# EAGLE schematic TIEVOX Interface (EAGLE 7.4.0)
Power Notes For IC_PWR_1 to work the way we want it to, meaning supplying power from the car, a value of 2.2K - 6K will work just fine for R1. That gives a turn on voltage of 5.5VDC to ~10VDC. All power inputs are poly fused and have a backpower diode circuit for protecting the RPi.
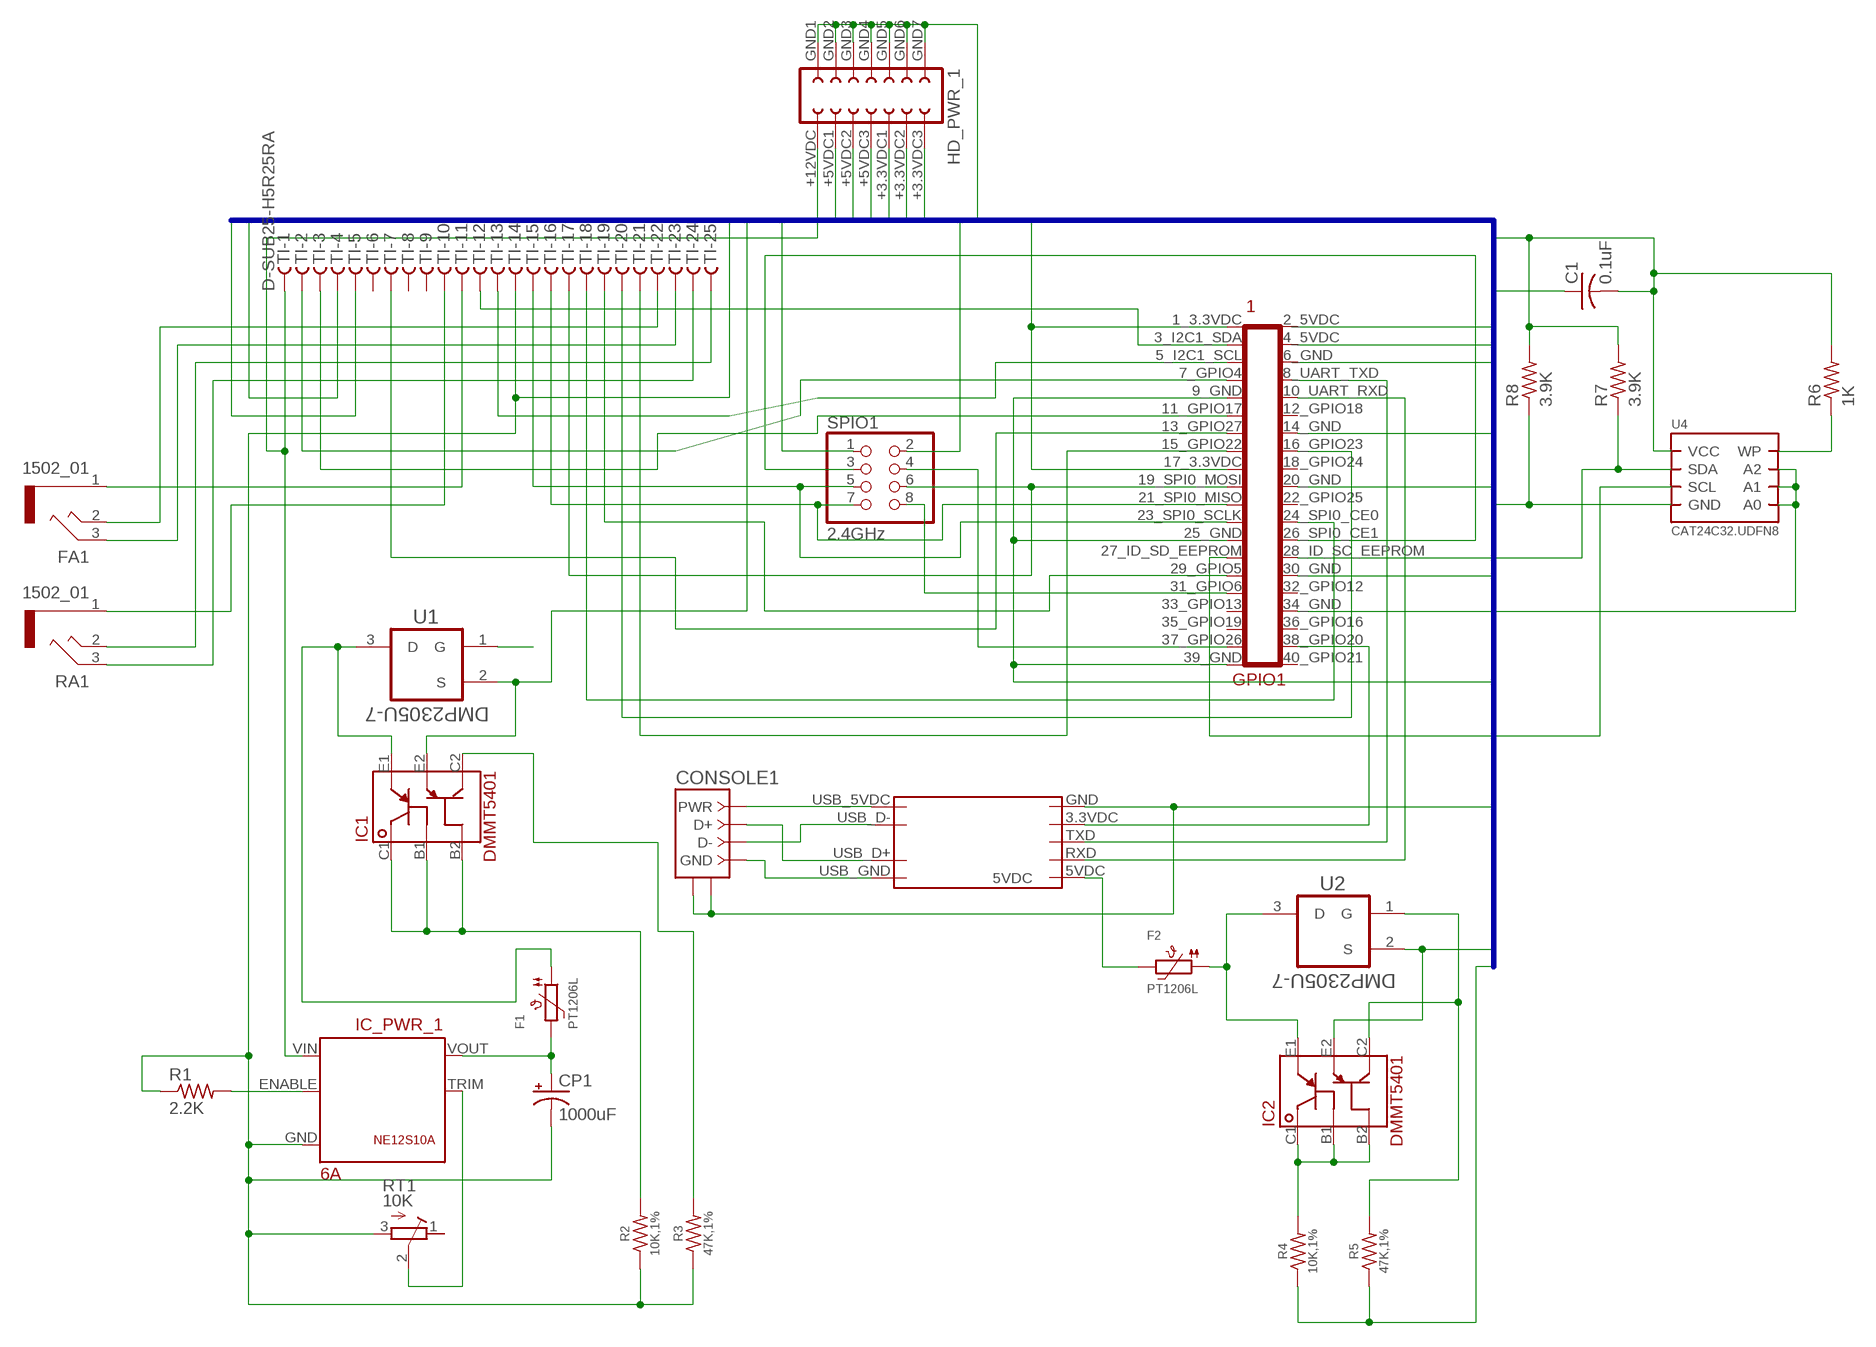
[diagram p0: schematic, sheet 1]

## Parts
C1  0.1uF  C-USC1005  [C1005]
CONSOLE1  USB-RA  [USBBF-1]
CP1  1000uF  CPOL-USE3.5-8  [E3,5-8]
F1  PT1206L  PTC1206  [1206]
F2  PT1206L  PTC1206  [1206]
FA1  1502_01  [1502_01]
GPIO1  RPI_GPIOUPPER  [RPI_GPIO_MALE]
HD_PWR_1  PWR_HDR_FEMALE_2X7  [PWR_HDR_FEMALE_2X7]
IC1  DMMT5401  DMMT5401DMMT  [DMMT5401]
IC2  DMMT5401  DMMT5401DMMT  [DMMT5401]
IC_PWR_1  6A  NE12S12V6A  [NE12S]
R1  2.2K  R-US_0207/10  [0207/10]
R2  10K,1%  R-US_01005  [R01005]
R3  47K,1%  R-US_01005  [R01005]
R4  10K,1%  R-US_01005  [R01005]
R5  47K,1%  R-US_01005  [R01005]
R6  1K  R-US_R1005  [R1005]
R7  3.9K  R-US_R1005  [R1005]
R8  3.9K  R-US_R1005  [R1005]
RA1  1502_01  [1502_01]
RT1  10K  R-TRIMM3006P  [RTRIM3006P]
SPIO1  2.4GHz  PINHD-2X4  [2X04]
TI  D-SUB25-H5R25RA  [H5R25RA]
U1  DMP2305U-7  [SOT103P240X110-3N]
U2  DMP2305U-7  [SOT103P240X110-3N]
U4  CAT24C32.UDFN8  CAT24CXX.UDFN8  [UDFN8]
UART1  GS27159  [GS27159]

## Nets
5VDC: F2.2 UART1.5VDC
+3.3VDC: C1.2 GPIO1.1_3.3VDC GPIO1.17_3.3VDC HD_PWR_1.+3.3VDC1 HD_PWR_1.+3.3VDC2 HD_PWR_1.+3.3VDC3 R6.2 R7.2 R8.2 SPIO1.2 TI.4 U4.8(VCC)
+5VDC: GPIO1.2_5VDC GPIO1.4_5VDC HD_PWR_1.+5VDC1 HD_PWR_1.+5VDC2 HD_PWR_1.+5VDC3 IC1.E2 IC2.E2 TI.5 U1.2(S) U2.2(S)
CONSOLE_ON: GPIO1.38_GPIO20 UART1.3.3VDC
GND: C1.1 CONSOLE1.CASE1(SHIELD1) CONSOLE1.CASE2(SHIELD2) CP1.- GPIO1.6_GND GPIO1.9_GND GPIO1.14_GND GPIO1.20_GND GPIO1.25_GND GPIO1.30_GND GPIO1.34_GND GPIO1.39_GND HD_PWR_1.GND1 HD_PWR_1.GND2 HD_PWR_1.GND3 HD_PWR_1.GND4 HD_PWR_1.GND5 HD_PWR_1.GND6 HD_PWR_1.GND7 IC_PWR_1.GND R1.1 R2.1 R3.1 R4.1 R5.1 R8.1 RT1.3(A) SPIO1.1 TI.14 U4.1(A0) U4.2(A1) U4.3(A2) U4.4(GND) U4.PAD(GND) UART1.GND
N$1: GPIO1.19_SPI0_MOSI SPIO1.6 TI.17
N$2: GPIO1.21_SPI0_MISO SPIO1.7 TI.16
N$3: GPIO1.23_SPI0_SCLK SPIO1.5 TI.15
N$4: GPIO1.26_SPI0_CE1 SPIO1.3
N$5: GPIO1.31_GPIO6 SPIO1.8
N$6: GPIO1.37_GPIO26 SPIO1.4
N$7: GPIO1.7_GPIO4 TI.2
N$8: GPIO1.11_GPIO17 TI.3
N$9: GPIO1.13_GPIO27 TI.7
N$10: GPIO1.24_SPI0_CE0 TI.18
N$11: GPIO1.29_GPIO5 TI.19
N$12: GPIO1.16_GPIO23 TI.20
N$13: GPIO1.15_GPIO22 TI.21
N$14: CONSOLE1.4(GND) UART1.USB_GND
N$15: CONSOLE1.1(PWR) UART1.USB_5VDC
N$16: CONSOLE1.2(D-) UART1.USB_D-
N$17: CONSOLE1.3(D+) UART1.USB_D+
N$18: GPIO1.8_UART_TXD(8_UART0_TXD) UART1.TXD
N$19: GPIO1.10_UART_RXD(10_UART0_RXD) UART1.RXD
N$20: FA1.1 TI.11
N$21: RA1.1 TI.10
N$22: RA1.3 TI.24
N$23: RA1.2 TI.25
N$24: FA1.3 TI.23
N$25: FA1.2 TI.22
N$26: GPIO1.3_I2C1_SDA TI.12
N$27: GPIO1.5_I2C1_SCL TI.13
N$28: CP1.+ F1.2 IC_PWR_1.VOUT
N$29: IC_PWR_1.ENABLE R1.2
N$30: F1.1 IC1.E1 U1.3(D)
N$31: IC1.B1 IC1.B2 IC1.C1 R2.2
N$32: F2.1 IC2.E1 U2.3(D)
N$33: IC1.C2 R3.2
N$34: IC2.C2 R5.2 U2.1(G)
N$35: IC2.B1 IC2.B2 IC2.C1 R4.2
N$36: U1.1(G)
N$38: GPIO1.27_ID_SD_EEPROM(27_ID_SC_EEPROM) U4.6(SCL)
N$39: R6.1 U4.7(WP)
N$40: GPIO1.28_ID_SC_EEPROM R7.1 U4.5(SDA)
PWR12_IN: HD_PWR_1.+12VDC IC_PWR_1.VIN TI.1
PWR12_TRIM: IC_PWR_1.TRIM RT1.2(S)
Unconnected: GPIO1.12_GPIO18 GPIO1.18_GPIO24 GPIO1.22_GPIO25 GPIO1.32_GPIO12 GPIO1.33_GPIO13 GPIO1.35_GPIO19 GPIO1.36_GPIO16 GPIO1.40_GPIO21 RT1.1(E) TI.6 TI.8 TI.9

## Buses
GND,+3.3VDC,+5VDC

## Library data of the parts
C1 = adafruit:C-US: CAPACITOR, American symbol
CONSOLE1 = connector:USB-R: USB connector, 2 shield pins; DESC: USB B socket; SUPPLIER: Jameco: 230958; VALSTAT: label
CP1 = rcl:CPOL-US: POLARIZED CAPACITOR, American symbol
F1 F2 = microbuilder:PTC: PTC (Resettable Fuse) 1206 Package 250mA PTC (16V Max, Time-to-Trip: 0.08s) - Digikey: F2110CT-ND 1210 Package 100mA PTC (30V Max, Time-to-Trip: 0.6s) - Digikey: MF-USMF010-2CT-ND 1812 Package 750mA PTC (24V Max, Time-to-Trip: 0.2s) - Digikey: MF-MSMF075/24-2CT-ND
FA1 RA1 = con-lumberg:1502_01: Jack connectors according to JISC 6560, 3.5 mm Klinkensteckverbinder nach JISC 6560, 3,5 mm Source: http://www.lumberg.com/Produkte/PDFs/1502_01.pdf; OC_FARNELL: 4739747; OC_NEWARK: unknown
GPIO1 = connectors:RPI_GPIO*: GPIO Connector for Raspberry Pi.
HD_PWR_1 = con-lsta:PWR_HDR_FEMALE_2X7: POWER HEADER, FEMALE 2x7
IC1 IC2 = Diodes_Inc_By_element14_Batch_1:DMMT5401
IC_PWR_1 = packages:NE12S*
R1 R6-R8 = adafruit:R-US_: RESISTOR, American symbol
R2-R5 = rcl:R-US_: RESISTOR, American symbol
RT1 = resistor:R-TRIMM: Trimm resistor
SPIO1 = pinhead:PINHD-2X4: PIN HEADER
TI = con-thomas-betts:D-SUB25-: D-Subminiatur Connector Source: Electronioc Interconnects European Edition 1998; MPN: H5R25RA29CS; OC_FARNELL: unknown; OC_NEWARK: 93F8340
U1 U2 = Diodes_Inc_By_element14_Batch_1:DMP2305U-7: P-CHANNEL ENHANCEMENT MODE MOSFET; MPN: DMP2305U-7; OC_FARNELL: 1858668; OC_NEWARK: 23T5607; PACKAGE: SOT-23-3; SUPPLIER: DIODES INC.
U4 = on-semiconductor:CAT24CXX
UART1 = packages:GS27159: From JBTek USB to Console Cable Board: TTD-C GS27159